# EAGLE design DUAL_OUT_LEDs (EAGLE 9.6.2)
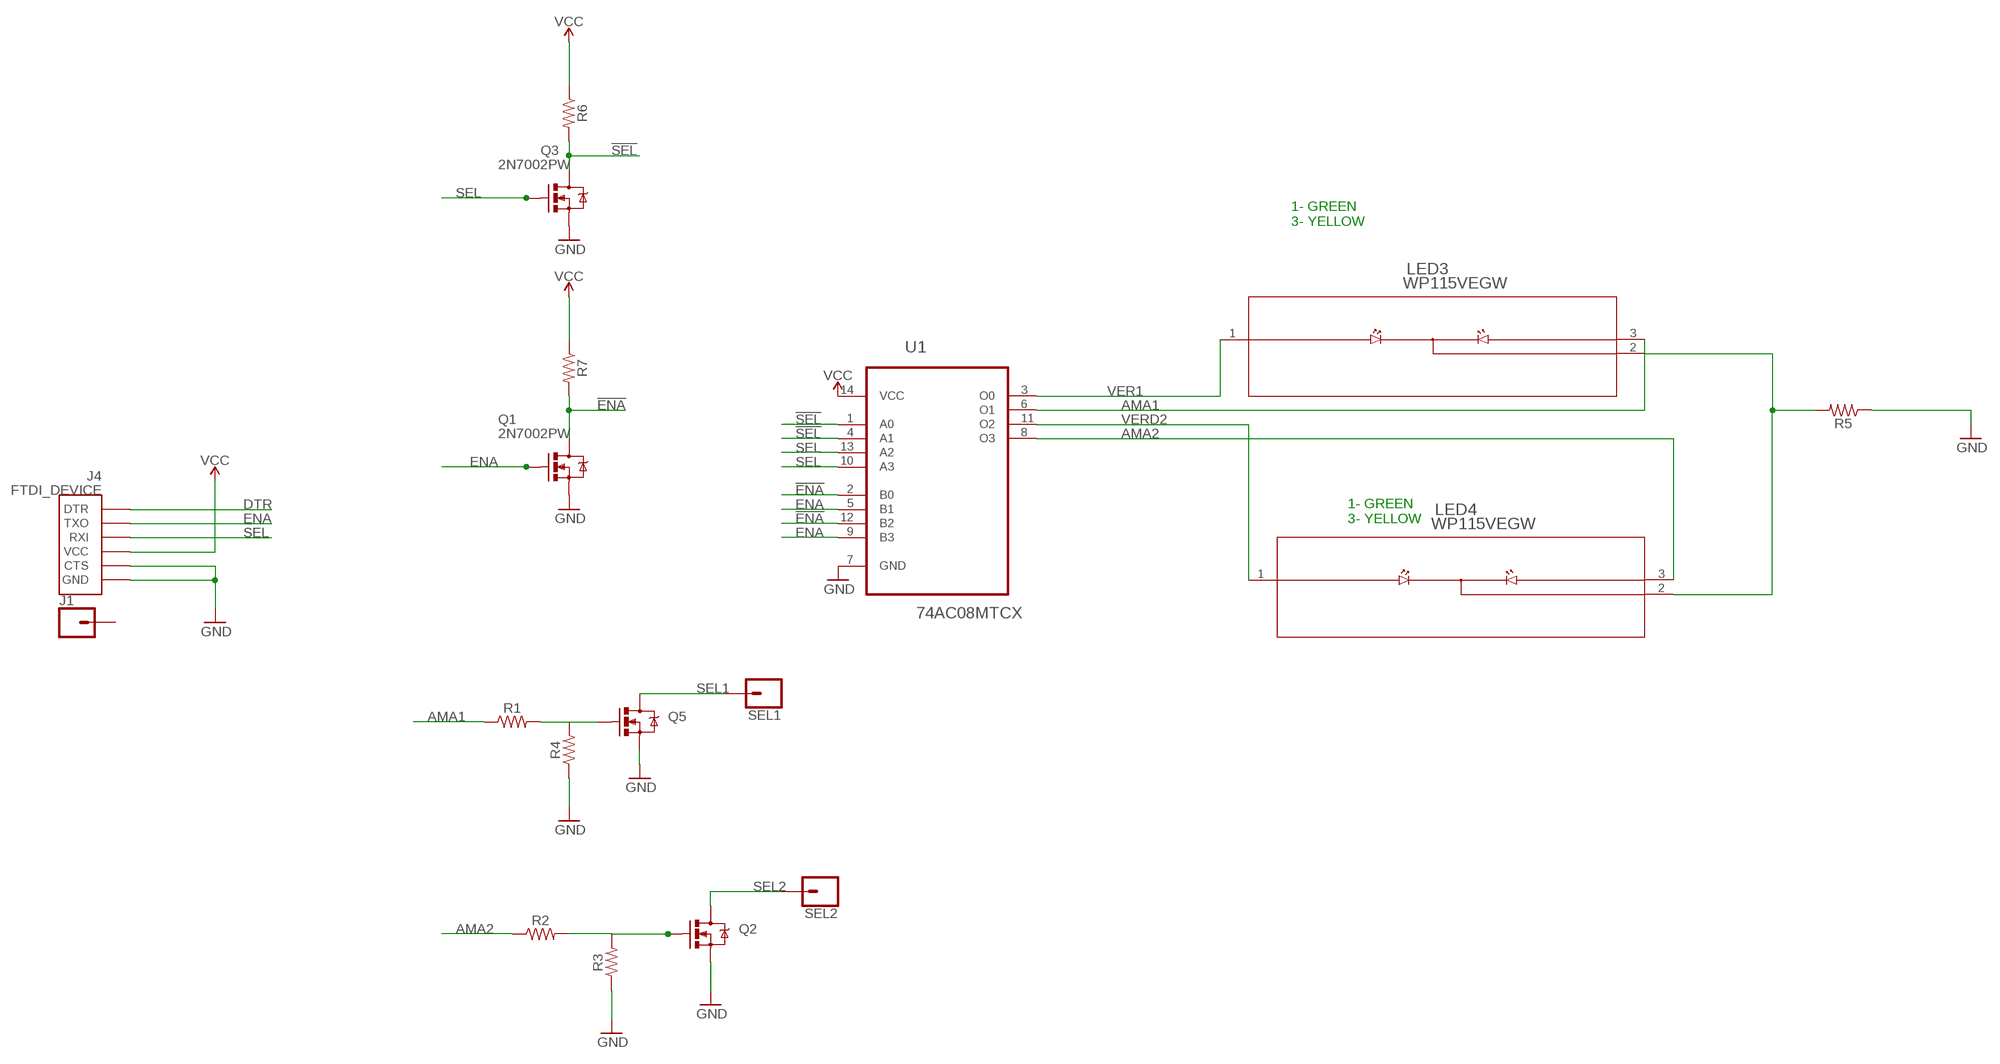
[diagram p0: schematic, sheet 1, part 1 of 2]
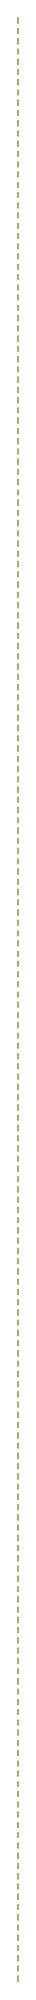
[diagram p1: schematic, sheet 1, part 2 of 2]

## Parts
J1  CONN_01  [1X01]
J4  FTDI_DEVICE  [FTDI_DEVICE_SIDE]
LED3  WP115VEGW  [WP115VEGW_KNB]
LED4  WP115VEGW  [WP115VEGW_KNB]
Q1  2N7002PW  MOSFET-NCHANNEL2N7002PW  [SOT323]
Q2  2N7002PW  MOSFET-NCHANNEL2N7002PW  [SOT323]
Q3  2N7002PW  MOSFET-NCHANNEL2N7002PW  [SOT323]
Q5  2N7002PW  MOSFET-NCHANNEL2N7002PW  [SOT323]
R1  RESISTOR0805  [0805]
R2  RESISTOR0805  [0805]
R3  RESISTOR0805  [0805]
R4  RESISTOR0805  [0805]
R5  RESISTOR0805  [0805]
R6  RESISTOR0805  [0805]
R7  RESISTOR0805  [0805]
SEL1  CONN_01  [1X01]
SEL2  CONN_01  [1X01]
U1  74AC08MTCX  [SOP65P640X120-14N]

## Nets
!ENA!: Q1.3(D) R7.2 U1.2(B0) U1.12(B2)
!SEL!: Q3.3(D) R6.2 U1.1(A0) U1.4(A1)
AMA1: LED3.3 R1.1 U1.6(O1)
AMA2: LED4.3 R2.1 U1.8(O3)
DTR: J4.P$1(DTR)
ENA: J4.P$2(TXO) Q1.1(G) U1.5(B1) U1.9(B3)
GND: J4.P$5(CTS) J4.P$6(GND) Q1.2(S) Q2.2(S) Q3.2(S) Q5.2(S) R3.1 R4.1 R5.1 U1.7(GND)
N$1: Q2.1(G) R2.2 R3.2
N$6: Q5.1(G) R1.2 R4.2
N$7: LED3.2 LED4.2 R5.2
SEL: J4.P$3(RXI) Q3.1(G) U1.10(A3) U1.13(A2)
SEL1: Q5.3(D) SEL1.1
SEL2: Q2.3(D) SEL2.1
VCC: J4.P$4(VCC) R6.1 R7.1 U1.14(VCC)
VER1: LED3.1 U1.3(O0)
VERD2: LED4.1 U1.11(O2)
Unconnected: J1.1

## Notes on the sheet
- 1- GREEN
  3- YELLOW
- 1- GREEN
  3- YELLOW

## Library data of the parts
J1 SEL1 SEL2 = SparkFun-Connectors:CONN_01: Single connection point. Often used as Generic Header-pin footprint for 0.1 inch spaced/style header connections On any of the 0.1 inch spaced packages, you can populate with these: Break Away Headers - Straight <https://www.sparkfun.com/products/116> (PRT-00116) Break Away Male Headers - Right Angle <https://www.sparkfun.com/products/553> (PRT-00553) Female Headers <https://www.sparkfun.com/products/115> (PRT-00115) Break Away Headers - Machine Pin <https://www.sparkfun.com/products/117> (PRT-00117) Break Away Female Headers - Swiss Machine Pin <https://www.sparkfun.com/products/743> (PRT-00743) This device is also useful as a general connection point to wire up your design to another part of your project. Our various solder wires solder well into these plated through hole pads. Hook-Up Wire - Assortment (Stranded, 22 AWG) <https://www.sparkfun.com/products/11375> (PRT-11375) Hook-Up Wire - Assortment (Solid Core, 22 AWG) <https://www.sparkfun.com/products/11367> (PRT-11367) View the entire wire category on our website here <https://www.sparkfun.com/categories/141> Special notes: SMTSO-256-ET is a "flush mount" nut for a 4-40 screw. We mostly use this on specialty testbeds; it is a nice way to connect hardware to your PCB at an adjustable hieght. Also note, the SNAP packages are for using a snappable style connector. We sell a baggie of snaps and they are also used on two LilyPad designs: Snap Assortment - 30 pack (male and female) <https://www.sparkfun.com/products/11347> (DEV-11347) LilyPad Arduino SimpleSnap <https://www.sparkfun.com/products/10941> (DEV-10941) LilyPad SimpleSnap Protoboard <https://www.sparkfun.com/products/10940> (DEV-10940)
J4 = SparkFun-Connectors:FTDI_DEVICE: Connector which mates to FTDI basic or FTDI cable.
LED3 LED4 = LED_BICOLOR_3mm:WP115VEGW; BUILT_BY: EMA_Cory; COPYRIGHT: Copyright (C) 2018 Accelerated Designs. All rights reserved; DATASHEET: http://www.kingbrightusa.com/images/catalog/SPEC/WP115VEGW.pdf; MANUFACTURER_PART_NUMBER: WP115VEGW; SOURCELIBRARY: Kingbright_2020-07-02; VENDOR: Kingbright
Q1-Q3 Q5 = SparkFun-DiscreteSemi:MOSFET-NCHANNEL: Common NMOSFET Parts MFG P/N Store ID Prod ID FDD8780 TRANS-09984 SI7820DN TRANS-11055 FDS6630A IC-08089 2N7002PW TRANS-11151 FQP30N06L COM-10213 TRANS-10060 BSS123LT1G TRANS-08345 BSS138 TRANS-00830 BS170 2N7000; PROD_ID: TRANS-11151
R1-R7 = SparkFun-Resistors:RESISTOR: Generic Resistor Package
U1 = 74AC08MTCX:74AC08MTCX: Quad 2-Input AND Gate; AVAILABILITY: Unavailable; DESCRIPTION: AND Gate IC 4 Channel 14-TSSOP; MF: ON; MP: 74AC08MTCX; PACKAGE: TSSOP WB-14 ON Semiconductor; PRICE: None

## Net classes
1 vcc: width 0.254 mm

## Board
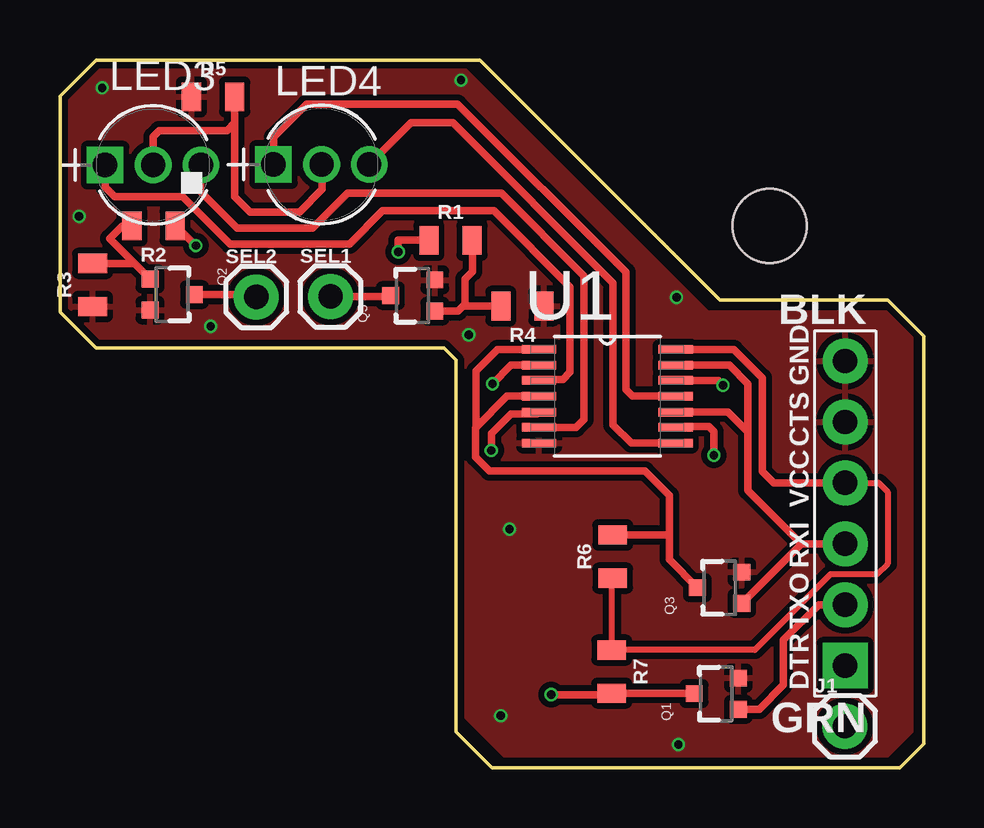
[diagram p2: board, top side]
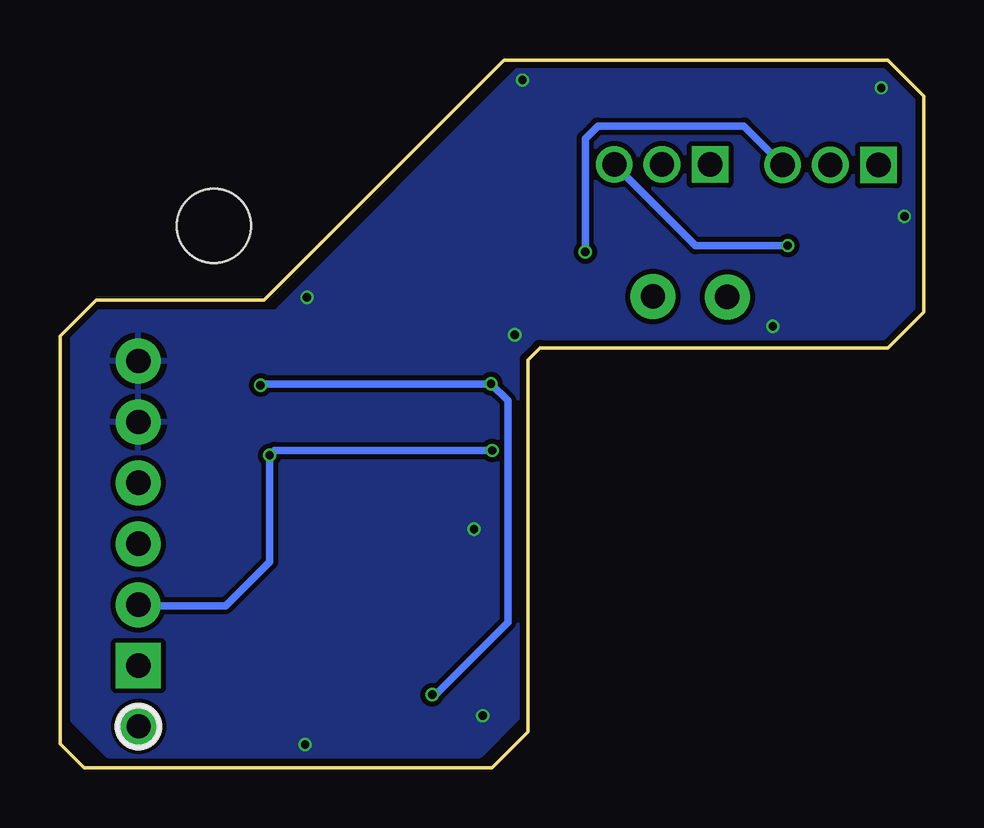
[diagram p3: board, bottom side, seen from below]

Size 36 x 29.5 mm. Coordinates in mm from the lower left corner, seen from the top.
Outline: 1.5,17.5 0,19 0,28 1.5,29.5 17.5,29.5 27.5,19.5 34.5,19.5 36,18 36,1 35,0 18,0 16.5,1.5 16.5,17 16,17.5 1.5,17.5
Copper layers (1*16): Top 0.035mm / dielectric 0.2mm / Bottom 0.035mm
Design rules "SeeedStudio_4layer_DRU_no_angle_20140221 *": minimum track width 8mil, minimum drill 12mil, track to track 8mil, track to pad 8mil, pad to pad 8mil, via to via 8mil, smd to smd 0mil, copper to edge 10mil, drill to drill 8mil, minimum pad ring 6mil, minimum via ring 4mil, stop-mask expansion 4mil, vias tented up to drill 25mil, thermal gap 10mil
Holes 3.1 mm at -56.42,22.58 29.58,22.58 -58.42,-8.42 31.58,-19.42

### Footprints (pad centres in the part's own frame; a part is rotated, then mirrored left to right if it is on the bottom)
1X01 = drill 1.016 pad 1.88: 1 0,0
FTDI_DEVICE_SIDE = drill 1.016 pad 1.88 square: P$1 -6.35,0 | drill 1.016 pad 1.88: P$2 -3.81,0; P$3 -1.27,0; P$4 1.27,0; P$5 3.81,0; P$6 6.35,0
WP115VEGW_KNB = drill 1.016 pad 1.524 square: 1 0,0 | drill 1.016 pad 1.524: 2 2.007,0; 3 3.988,0
SOT323 = smd 0.7 x 0.7: 1 -0.65,-0.925; 2 0.65,-0.925; 3 0,0.925
0805 = smd 0.8 x 1.2: 1 -0.9,0; 2 0.9,0
SOP65P640X120-14N = smd 1.422 x 0.356: 1 -2.845,1.956; 2 -2.845,1.295; 3 -2.845,0.66; 4 -2.845,0; 5 -2.845,-0.66; 6 -2.845,-1.295; 7 -2.845,-1.956; 8 2.845,-1.956; 9 2.845,-1.295; 10 2.845,-0.66; 11 2.845,0; 12 2.845,0.66; 13 2.845,1.295; 14 2.845,1.956

### Placement (x,y rotation side)
J1  32.72,1.72 0 top
J4  32.73,10.6 90 top
LED3  1.88,25.12 0 top
LED4  8.9,25.14 0 top
Q1  27.36,3.08 90 top
Q2  4.68,19.72 270 top
Q3  27.5,7.5 90 top
Q5  14.7,19.68 90 top
R1  16.28,21.98 0 top
R2  3.9,22.58 180 top
R3  1.36,20.12 90 top
R4  19.28,19.24 180 top
R5  6.38,27.96 0 top
R6  23.04,8.8 90 top
R7  23,4 270 top
SEL1  11.28,19.64 0 top
SEL2  8.18,19.62 0 top
U1  22.82,15.48 0 top

### Tracks (layer width: path | path; a pad name or v marks a point on that pad's centre or on a via)
!ENA!  (via drill 0.35)
  Top 0.305: U1.2 18.81,16.77 v18.03,16 | v27.64,15.94 27.44,16.14 U1.12 | v20.48,3.04 22.94,3.04 R7.2 26.42,3.1 Q1.3
  Bottom 0.305: v27.64,15.94 27.64,16 v18.03,16 17.33,15.3 17.33,6.06 20.35,3.04 v20.48,3.04
!SEL!
  Top 0.305: Q3.3 25.4,8.68 25.4,9.7 | 25.4,9.7 25.4,11.34 24.38,12.36 17.9,12.36 17.32,12.94 17.32,14.16 17.34,14.18 | 17.34,14.18 18.64,15.48 U1.4 | 17.34,14.18 17.34,16.54 18.24,17.44 U1.1 | R6.2 25.4,9.7
AMA1  (via drill 0.35)
  Top 0.305: U1.6 21.5,14.18 21.84,14.52 21.84,20.5 18.4,23.94 11.98,23.94 10.53,22.49 7.39,22.49 5.87,24.01 LED3.3 | R1.1 14.1,21.98 v14.1,21.5
  Bottom 0.305: v14.1,21.5 14.1,26.22 13.58,26.74 7.49,26.74 LED3.3
AMA2  (via drill 0.35)
  Top 0.305: U1.8 23.82,13.52 23.06,14.28 23.06,20.2 16.38,26.88 14.63,26.88 LED4.3 | R2.1 4.84,22.58 v5.66,21.76
  Bottom 0.305: v5.66,21.76 9.51,21.76 LED4.3
ENA  (via drill 0.35)
  Top 0.305: Q1.1 29.15,2.43 30.16,3.44 30.16,5.32 31.63,6.79 J4.P$2 | U1.5 19.89,14.74 18.8,14.74 17.98,13.93 v17.98,13.22 | v27.26,13.02 27.26,14.02 27.06,14.22 25.7,14.22 U1.9
  Bottom 0.305: v17.98,13.22 27.06,13.22 v27.26,13.02 27.26,8.58 29.1,6.74 32.69,6.74 J4.P$2
GND  (via drill 0.35)
  other vias: 1.76,28.34 0.8,22.98 6.28,18.4 17.04,18.04 25.7,19.6 16.72,28.66 18.74,9.94 18.38,2.16 25.78,0.96
  pour Top (isolate 0.254): 0.12,27.62 1.64,29.14 16.86,29.14 27,19 34.5,19 35.5,18 35.5,1.5 34.5,0.5 18.5,0.5 16.92,2.08 16.92,17.08 16.52,17.48 1.46,17.48 0.12,18.82
  pour Bottom: 0.06,27.56 1.58,29.08 16.92,29.08 27,19 34.5,19 35.5,18 35.5,2 34,0.5 18.5,0.5 16.9,2.1 16.9,17.1 16.4,17.6 1.36,17.6 0.06,18.9
N$1
  Top 0.305: R3.2 3.11,21.02 Q2.1 2.07,22.05 2.6,22.58 R2.2
N$6
  Top 0.305: Q5.1 16.59,19.03 16.8,19.24 16.88,19.24 | 16.88,19.24 R4.2 | R1.2 17.2,21.98 17.2,20.68 16.88,20.36 16.88,19.24
N$7
  Top 0.305: LED3.2 3.89,26.31 4.14,26.56 6.96,26.56 7.28,26.88 | 7.28,26.88 R5.2 | LED4.2 10.91,25.12 10.93,25.1 10.93,24.11 9.98,23.16 7.92,23.16 7.28,23.8 7.28,26.88
SEL
  Top 0.305: Q3.1 30.9,9.33 | 30.9,9.33 J4.P$3 | 30.9,9.33 28.68,11.55 28.68,13.98 | 28.68,13.98 27.84,14.82 U1.10 | 28.68,13.98 28.68,16 27.91,16.77 U1.13
SEL1
  Top 0.305: SEL1.1 13.73,19.64 Q5.3
SEL2
  Top 0.305: Q2.3 8.08,19.72 SEL2.1
VCC
  Top 0.254: J4.P$4 34.13,11.87 34.5,11.5 34.5,8.5 34.06,8.06 32.12,8.06 28.96,4.9 R7.1 23,7.86 R6.1
  Top 0.305: U1.14 28.08,17.44 29.28,16.24 29.28,12.34 29.75,11.87 J4.P$4
VER1
  Top 0.305: U1.3 20.02,16.18 20.96,16.18 21.26,16.48 21.26,20.04 18.09,23.21 13.45,23.21 12.07,21.83 7.09,21.83 5.12,23.8 2.28,23.8 1.88,24.2 LED3.1
VERD2
  Top 0.305: U1.11 23.86,15.48 23.58,15.76 23.59,15.76 23.59,20.65 16.58,27.66 10.28,27.66 8.9,26.28 LED4.1